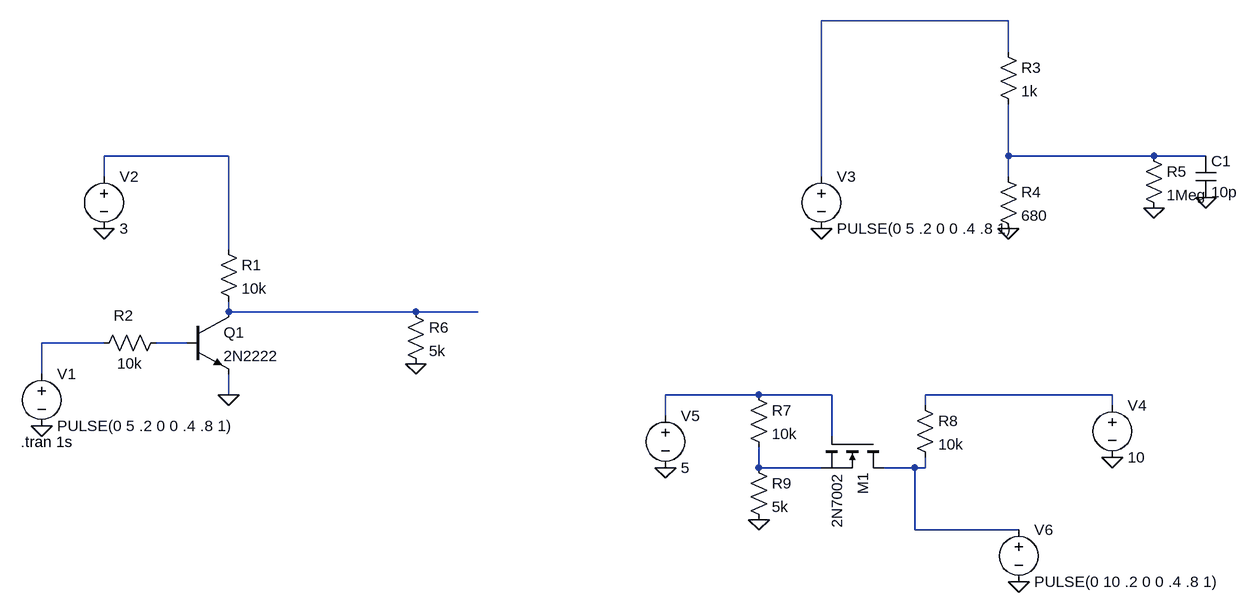
[diagram p0: schematic Draft8.asc]
Draft8.asc, the LTspice schematic file:
Version 4
SHEET 1 1752 680
WIRE 1376 -336 1088 -336
WIRE 1376 -288 1376 -336
WIRE 176 -128 -16 -128
WIRE 1376 -128 1376 -208
WIRE 1600 -128 1376 -128
WIRE 1680 -128 1600 -128
WIRE -16 -96 -16 -128
WIRE 1088 -96 1088 -336
WIRE 1376 -96 1376 -128
WIRE 176 16 176 -128
WIRE 176 112 176 96
WIRE 464 112 176 112
WIRE 560 112 464 112
WIRE -16 160 -112 160
WIRE 112 160 64 160
WIRE -112 208 -112 160
WIRE 176 240 176 208
WIRE 992 240 848 240
WIRE 1104 240 992 240
WIRE 1536 240 1248 240
WIRE 1248 256 1248 240
WIRE 1536 256 1536 240
WIRE 848 272 848 240
WIRE 1104 304 1104 240
WIRE 992 352 992 320
WIRE 1088 352 992 352
WIRE 1232 352 1184 352
WIRE 1248 352 1248 336
WIRE 1248 352 1232 352
WIRE 1232 448 1232 352
WIRE 1392 448 1232 448
FLAG 176 240 0
FLAG -112 288 0
FLAG -16 -16 0
FLAG 1088 -16 0
FLAG 1376 -16 0
FLAG 1600 -48 0
FLAG 1680 -64 0
FLAG 464 192 0
FLAG 848 352 0
FLAG 1392 528 0
FLAG 1536 336 0
FLAG 992 432 0
SYMBOL npn 112 112 R0
SYMATTR InstName Q1
SYMATTR Value 2N2222
SYMBOL res 160 0 R0
SYMATTR InstName R1
SYMATTR Value 10k
SYMBOL voltage -112 192 R0
WINDOW 123 0 0 Left 0
WINDOW 39 0 0 Left 0
SYMATTR InstName V1
SYMATTR Value PULSE(0 5 .2 0 0 .4 .8 1)
SYMBOL voltage -16 -112 R0
WINDOW 123 0 0 Left 0
WINDOW 39 0 0 Left 0
SYMATTR InstName V2
SYMATTR Value 3
SYMBOL res 80 144 R90
WINDOW 0 -11 66 VBottom 2
WINDOW 3 32 56 VTop 2
SYMATTR InstName R2
SYMATTR Value 10k
SYMBOL voltage 1088 -112 R0
WINDOW 123 0 0 Left 0
WINDOW 39 0 0 Left 0
SYMATTR InstName V3
SYMATTR Value PULSE(0 5 .2 0 0 .4 .8 1)
SYMBOL res 1360 -304 R0
SYMATTR InstName R3
SYMATTR Value 1k
SYMBOL res 1360 -112 R0
SYMATTR InstName R4
SYMATTR Value 680
SYMBOL res 1584 -144 R0
SYMATTR InstName R5
SYMATTR Value 1Meg
SYMBOL cap 1664 -128 R0
SYMATTR InstName C1
SYMATTR Value 10p
SYMBOL res 448 96 R0
SYMATTR InstName R6
SYMATTR Value 5k
SYMBOL nmos 1184 304 R90
SYMATTR InstName M1
SYMATTR Value 2N7002
SYMBOL res 976 224 R0
SYMATTR InstName R7
SYMATTR Value 10k
SYMBOL res 1232 240 R0
SYMATTR InstName R8
SYMATTR Value 10k
SYMBOL voltage 1536 240 R0
WINDOW 123 0 0 Left 0
WINDOW 39 0 0 Left 0
SYMATTR InstName V4
SYMATTR Value 10
SYMBOL voltage 848 256 R0
WINDOW 123 0 0 Left 0
WINDOW 39 0 0 Left 0
SYMATTR InstName V5
SYMATTR Value 5
SYMBOL voltage 1392 432 R0
WINDOW 123 0 0 Left 0
WINDOW 39 0 0 Left 0
SYMATTR InstName V6
SYMATTR Value PULSE(0 10 .2 0 0 .4 .8 1)
SYMBOL res 976 336 R0
SYMATTR InstName R9
SYMATTR Value 5k
TEXT -144 312 Left 2 !.tran 1s

The netlist it stands for:
* Draft8.asc
Q1 N004 N006 0 0 2N2222
R1 N002 N004 10k
V1 N005 0 PULSE(0 5 .2 0 0 .4 .8 1)
V2 N002 0 3
R2 N006 N005 10k
V3 N001 0 PULSE(0 5 .2 0 0 .4 .8 1)
R3 N001 N003 1k
R4 N003 0 680
R5 N003 0 1Meg
C1 N003 0 10p
R6 N004 0 5k
M1 N010 N007 N009 N009 2N7002
R7 N007 N009 10k
R8 N008 N010 10k
V4 N008 0 10
V5 N007 0 5
V6 N010 0 PULSE(0 10 .2 0 0 .4 .8 1)
R9 N009 0 5k
.model NPN NPN
.model PNP PNP
.lib standard.bjt
.model NMOS NMOS
.model PMOS PMOS
.lib standard.mos
.tran 1s
.backanno
.end